# Altium schematic sheet 08_SOM_USB_CARD.SchDoc
size 420 x 297 mm; SheetNumber: 17; SheetTotal: 33
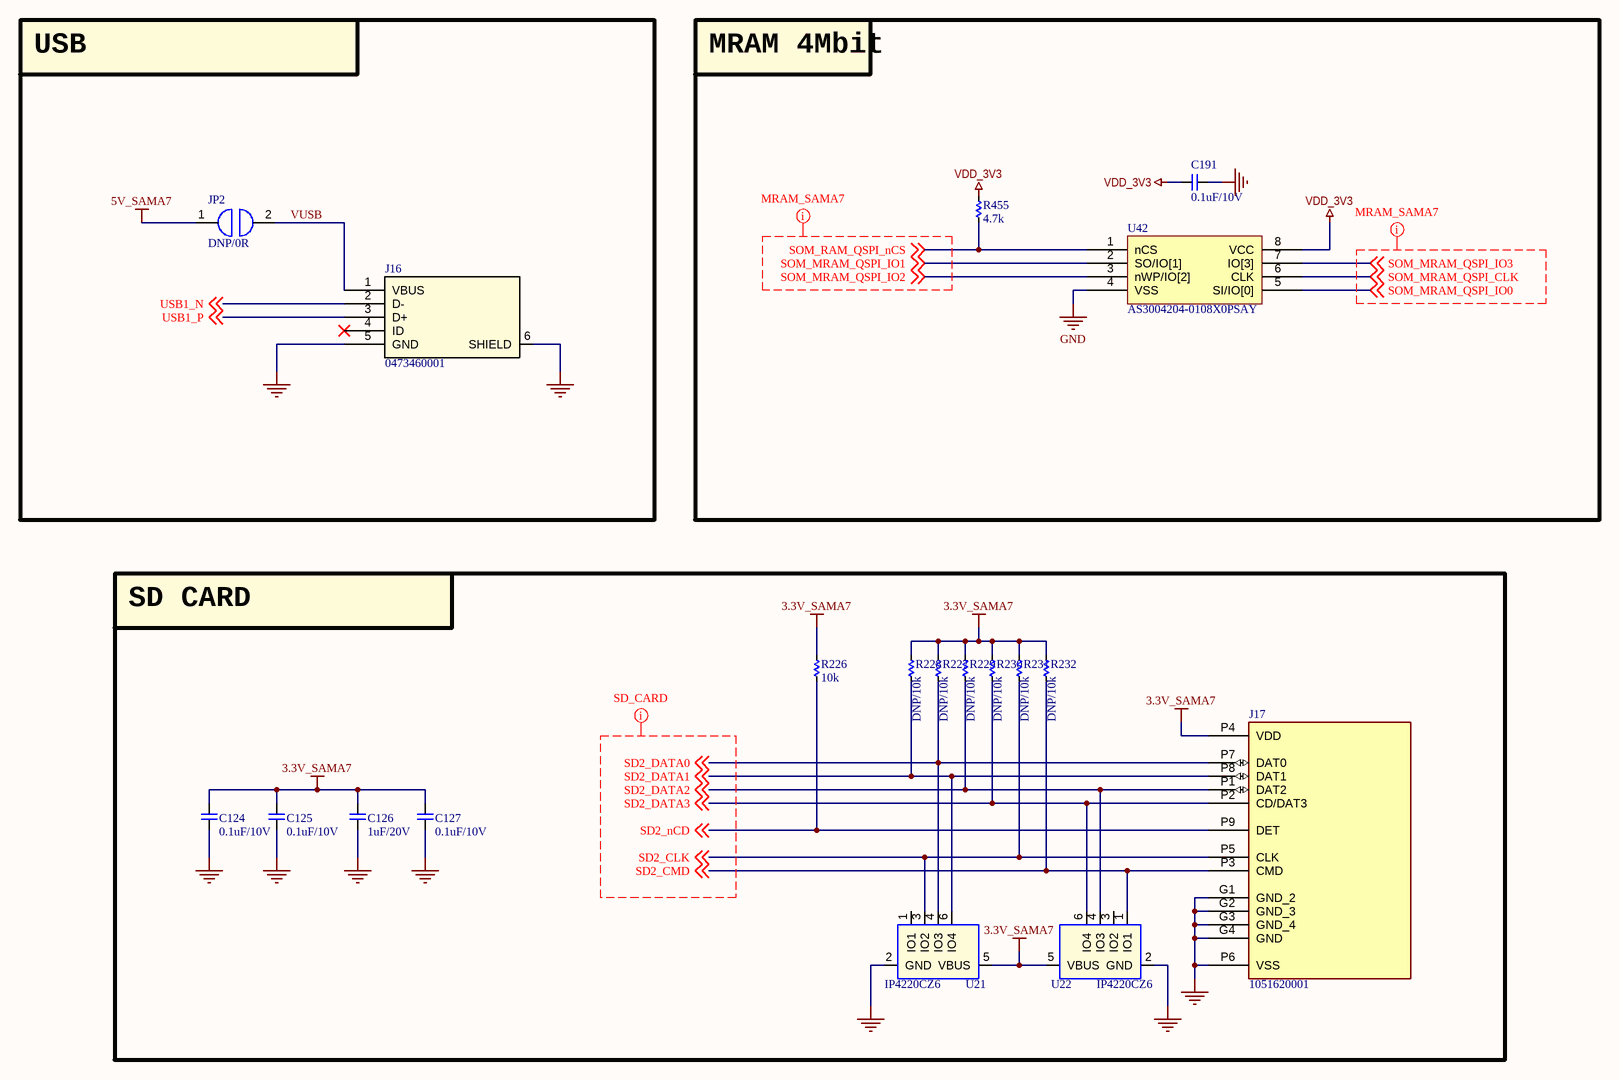
[diagram p0: 08_SOM_USB_CARD.SchDoc]

## Parts
C124  0.1uF/10V  [CAP_C_1005X50_L]
C125  0.1uF/10V  [CAP_C_1005X50_L]
C126  1uF/20V  [CAP_C_1005X50_L]
C127  0.1uF/10V  [CAP_C_1005X50_L]
C191  0.1uF/10V  [CAP_C_1005X50_L]
J16  0473460001  [47346-0001_MOL]
J17  1051620001  [Molex_1051620001]
JP2  DNP/0R  [JUMPER_1608]
R226  10k  [RES_C_1005x30_L]
R227  DNP/10k  [RES_C_1005x30_L]
R228  DNP/10k  [RES_C_1005x30_L]
R229  DNP/10k  [RES_C_1005x30_L]
R230  DNP/10k  [RES_C_1005x30_L]
R231  DNP/10k  [RES_C_1005x30_L]
R232  DNP/10k  [RES_C_1005x30_L]
R455  4.7k  [RES_C_1005x30_L]
U21  IP4220CZ6  [SOT95P280X145-6N]
U22  IP4220CZ6  [SOT95P280X145-6N]
U42  AS3004204-0108X0PSAY  [SOIC127P790X216-8]

## Blocks framed on the sheet
USB: J16 JP2
MRAM 4Mbit: C191 R455 U42
SD CARD: C124-C127 J17 R226-R232 U21 U22

## Nets
3.3V_SAMA7: C124.2 C125.2 C126.2 C127.2 J17.P4(VDD) R226.2 R227.2 R228.2 R229.2 R230.2 R231.2 R232.2 U21.5(VBUS) U22.5(VBUS)
5V_SAMA7: JP2.1
GND: C124.1 C125.1 C126.1 C127.1 C191.1 J16.5(GND) J16.6(SHIELD) J17.G1(GND_2) J17.G2(GND_3) J17.G3(GND_4) J17.G4(GND) J17.P6(VSS) U21.2(GND) U22.2(GND) U42.4(VSS)
VDD_3V3: C191.2 R455.2 U42.8(VCC)
SD2_CLK: J17.P5(CLK) R231.1 U21.3(IO2) ; off-sheet SD2_CLK
SD2_CMD: J17.P3(CMD) R232.1 U22.1(IO1) ; off-sheet SD2_CMD
SD2_DATA0: J17.P7(DAT0) R227.1 U21.4(IO3) ; off-sheet SD2_DATA0
SD2_DATA1: J17.P8(DAT1) R228.1 U21.6(IO4) ; off-sheet SD2_DATA1
SD2_DATA2: J17.P1(DAT2) R229.1 U22.4(IO3) ; off-sheet SD2_DATA2
SD2_DATA3: J17.P2(CD/DAT3) R230.1 U22.6(IO4) ; off-sheet SD2_DATA3
SD2_nCD: J17.P9(DET) R226.1 ; off-sheet SD2_nCD
SOM_MRAM_QSPI_CLK: U42.6(CLK) ; off-sheet SOM_MRAM_QSPI_CLK
SOM_MRAM_QSPI_IO0: U42.5(SI/IO[0]) ; off-sheet SOM_MRAM_QSPI_IO0
SOM_MRAM_QSPI_IO1: U42.2(SO/IO[1]) ; off-sheet SOM_MRAM_QSPI_IO1
SOM_MRAM_QSPI_IO2: U42.3(nWP/IO[2]) ; off-sheet SOM_MRAM_QSPI_IO2
SOM_MRAM_QSPI_IO3: U42.7(IO[3]) ; off-sheet SOM_MRAM_QSPI_IO3
SOM_RAM_QSPI_nCS: R455.1 U42.1(nCS) ; off-sheet SOM_RAM_QSPI_nCS
USB1_N: J16.2(D-) ; off-sheet USB1_N
USB1_P: J16.3(D+) ; off-sheet USB1_P
VUSB: J16.1(VBUS) JP2.2

Not connected (* = marked no-connect by the designer): J16 4(ID)*; U21 1(IO1); U22 3(IO2)

## Layout directives
net class MRAM_SAMA7: SOM_MRAM_QSPI_CLK, SOM_MRAM_QSPI_IO0, SOM_MRAM_QSPI_IO1, SOM_MRAM_QSPI_IO2, SOM_MRAM_QSPI_IO3, SOM_RAM_QSPI_nCS
net class SD_CARD: SD2_CLK, SD2_CMD, SD2_DATA0, SD2_DATA1, SD2_DATA2, SD2_DATA3, SD2_nCD

## Notes on the sheet
- Project:
- BEE-1012
- Sub-system:
- SATELLITE_EXP_CONTROLLER
- Design by:
- SANG HUYNH
- BAO BUI
- Sheet title:
- Sheet
- A3
- of
- Checked by:
- Approved by:
- VU PHAM
- Revision:
- Document No:
- Size:
- Date:

## Library data of the parts
C124-C127 C191 = _CAP_C_2: CAP
J16 = USB_micro: No Description Available; Mfr_Name: Molex Connector Corporation; RefDes: RefDes; Type: Type
J17 = Molex_1051620001: 9 (8 + 1) Position Card Connector Secure Digital - microSDâ„¢ Surface Mount, Right Angle Gold; MF: Molex; SnapEDA_Link: https://www.snapeda.com/parts/1051620001/Molex/view-part/?ref=snap; Package: None; Value: *; MP: 1051620001; Check_prices: https://www.snapeda.com/parts/1051620001/Molex/view-part/?ref=eda
JP2 = JUMPER
R226-R232 R455 = _RES_B_2: RES
U21 U22 = IP4220CZ6_0: P/N: 132D42200S; PCB Footprint: SOT23-6L; CLABCONF0: =SB-UCMIMX93
U42 = IC_RAM_AS3004204-0108X0PSAY